# EAGLE design Servo Bonnet rev B (EAGLE 6.4)

## Sheet 1 of 2
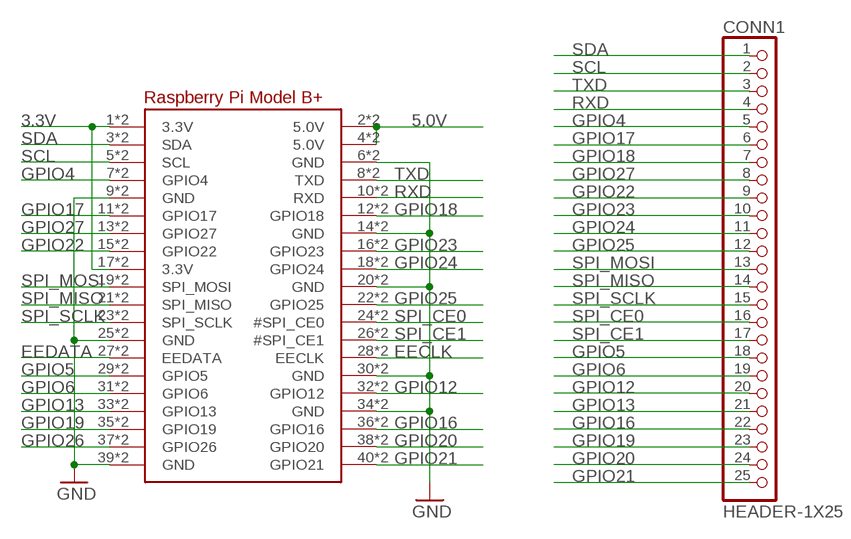
[diagram p0: schematic, sheet 1]

### Parts
CONN1  HEADER-1X25  [1X25_ROUND_70MIL]
RPI1  RASPBERRYPI_BPLUS_BONNET_THMSMT  [PI_BONNET_THMSMT]

### Nets
3.3V: RPI1.1(3.3V) RPI1.17(3.3V) RPI1.S1(3.3V) RPI1.S17(3.3V) ; also sheet 2
5.0V: RPI1.2(5.0V) RPI1.4(5.0V) RPI1.S2(5.0V) RPI1.S4(5.0V) ; also sheet 2
EECLK: RPI1.28(EECLK) RPI1.S28(EECLK)
EEDATA: RPI1.27(EEDATA) RPI1.S27(EEDATA)
GND: RPI1.6(GND) RPI1.9(GND) RPI1.14(GND) RPI1.20(GND) RPI1.25(GND) RPI1.30(GND) RPI1.34(GND) RPI1.39(GND) RPI1.S6(GND) RPI1.S9(GND) RPI1.S14(GND) RPI1.S20(GND) RPI1.S25(GND) RPI1.S30(GND) RPI1.S34(GND) RPI1.S39(GND) ; also sheet 2
GPIO4: CONN1.5 RPI1.7(GPIO4) RPI1.S7(GPIO4)
GPIO5: CONN1.18 RPI1.29(GPIO5) RPI1.S29(GPIO5)
GPIO6: CONN1.19 RPI1.31(GPIO6) RPI1.S31(GPIO6)
GPIO12: CONN1.20 RPI1.32(GPIO12) RPI1.S32(GPIO12)
GPIO13: CONN1.21 RPI1.33(GPIO13) RPI1.S33(GPIO13)
GPIO16: CONN1.22 RPI1.36(GPIO16) RPI1.S36(GPIO16)
GPIO17: CONN1.6 RPI1.11(GPIO17) RPI1.S11(GPIO17)
GPIO18: CONN1.7 RPI1.12(GPIO18) RPI1.S12(GPIO18)
GPIO19: CONN1.23 RPI1.35(GPIO19) RPI1.S35(GPIO19)
GPIO20: CONN1.24 RPI1.38(GPIO20) RPI1.S38(GPIO20)
GPIO21: CONN1.25 RPI1.40(GPIO21) RPI1.S40(GPIO21)
GPIO22: CONN1.9 RPI1.15(GPIO22) RPI1.S15(GPIO22)
GPIO23: CONN1.10 RPI1.16(GPIO23) RPI1.S16(GPIO23)
GPIO24: CONN1.11 RPI1.18(GPIO24) RPI1.S18(GPIO24)
GPIO25: CONN1.12 RPI1.22(GPIO25) RPI1.S22(GPIO25)
GPIO26: RPI1.37(GPIO26) RPI1.S37(GPIO26)
GPIO27: CONN1.8 RPI1.13(GPIO27) RPI1.S13(GPIO27)
RXD: CONN1.4 RPI1.10(RXD) RPI1.S10(RXD)
SCL: CONN1.2 RPI1.5(SCL) RPI1.S5(SCL) ; also sheet 2
SDA: CONN1.1 RPI1.3(SDA) RPI1.S3(SDA) ; also sheet 2
SPI_CE0: CONN1.16 RPI1.24(#SPI_CE0) RPI1.S24(#SPI_CE0)
SPI_CE1: CONN1.17 RPI1.26(#SPI_CE1) RPI1.S26(#SPI_CE1)
SPI_MISO: CONN1.14 RPI1.21(SPI_MISO) RPI1.S21(SPI_MISO)
SPI_MOSI: CONN1.13 RPI1.19(SPI_MOSI) RPI1.S19(SPI_MOSI)
SPI_SCLK: CONN1.15 RPI1.23(SPI_SCLK) RPI1.S23(SPI_SCLK)
TXD: CONN1.3 RPI1.8(TXD) RPI1.S8(TXD)

## Sheet 2 of 2
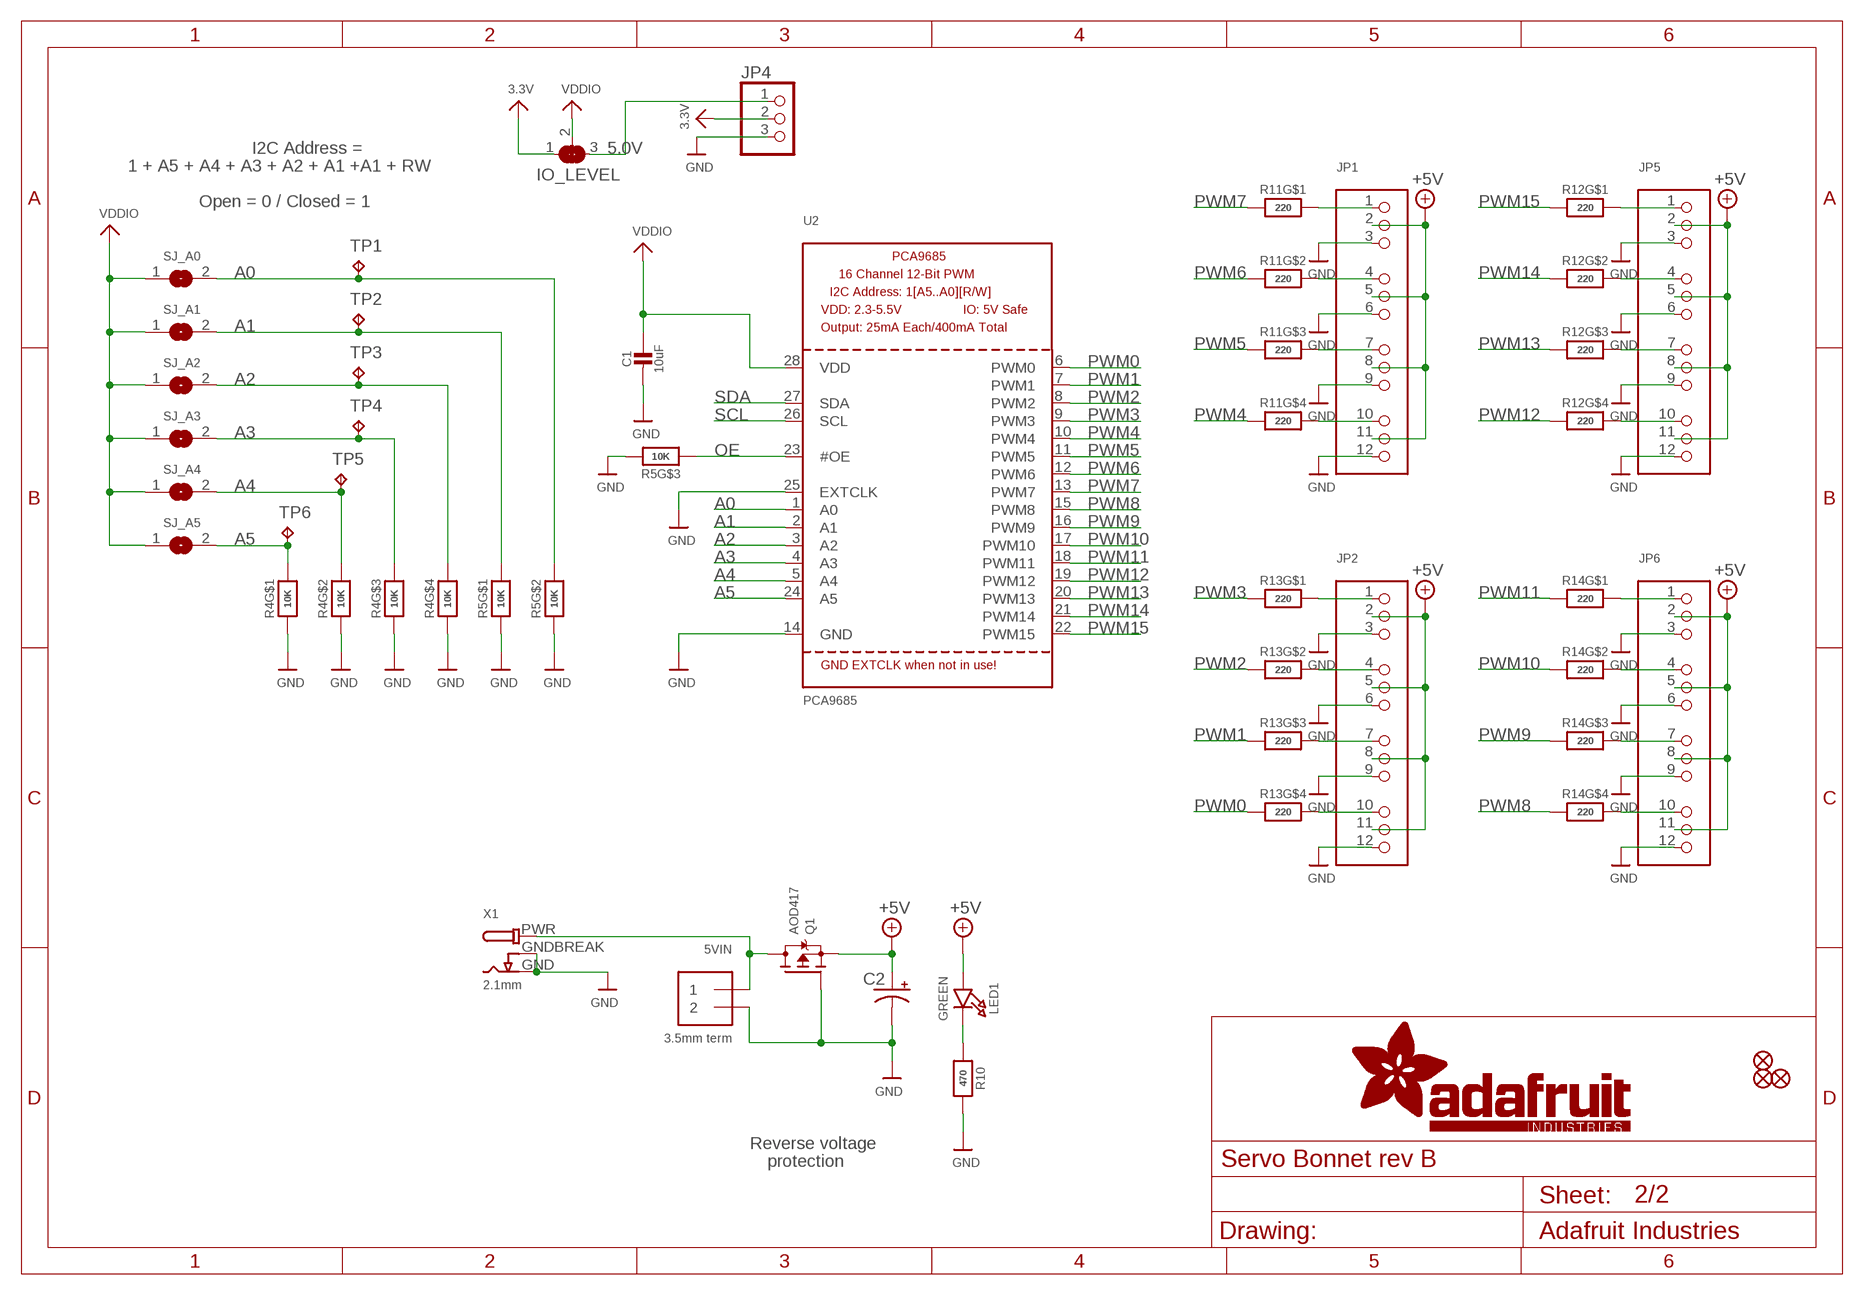
[diagram p1: schematic, sheet 2]

### Parts
5VIN  3.5mm term  TERMBLOCK_1X2  [TERMBLOCK_1X2-3.5MM]
C1  10uF  CAP_CERAMIC0805-NOOUTLINE  [0805-NO]
C2  CPOL-USE3.5-8  [E3,5-8]
FID1  FIDUCIAL_1MM  [FIDUCIAL_1MM]
FID2  FIDUCIAL_1MM  [FIDUCIAL_1MM]
FID3  FIDUCIAL_1MM  [FIDUCIAL_1MM]
IO_LEVEL  SOLDERJUMPER_2WAY  [SOLDERJUMPER_2WAY_OPEN_NOPASTE]
JP1  HEADER-3X04  [3X04]
JP2  HEADER-3X04  [3X04]
JP4  HEADER-1X3ROUND  [1X03_ROUND]
JP5  HEADER-3X04  [3X04]
JP6  HEADER-3X04  [3X04]
LED1  GREEN  LED0805_NOOUTLINE  [CHIPLED_0805_NOOUTLINE]
Q1  AOD417  MOSFET-PTO252  [TO252]
R4  10K  RESISTOR_4PACK  [RESPACK_4X0603]
R5  10K  RESISTOR_4PACK  [RESPACK_4X0603]
R10  470  RESISTOR_0603_NOOUT  [0603-NO]
R11  220  RESISTOR_4PACK  [RESPACK_4X0603]
R12  220  RESISTOR_4PACK  [RESPACK_4X0603]
R13  220  RESISTOR_4PACK  [RESPACK_4X0603]
R14  220  RESISTOR_4PACK  [RESPACK_4X0603]
SJ_A0  SOLDERJUMPERREFLOW_NOPASTE  [SOLDERJUMPER_REFLOW_NOPASTE]
SJ_A1  SOLDERJUMPERREFLOW_NOPASTE  [SOLDERJUMPER_REFLOW_NOPASTE]
SJ_A2  SOLDERJUMPERREFLOW_NOPASTE  [SOLDERJUMPER_REFLOW_NOPASTE]
SJ_A3  SOLDERJUMPERREFLOW_NOPASTE  [SOLDERJUMPER_REFLOW_NOPASTE]
SJ_A4  SOLDERJUMPERREFLOW_NOPASTE  [SOLDERJUMPER_REFLOW_NOPASTE]
SJ_A5  SOLDERJUMPERREFLOW_NOPASTE  [SOLDERJUMPER_REFLOW_NOPASTE]
TP1  TPB1,27  [B1,27]
TP2  TPB1,27  [B1,27]
TP3  TPB1,27  [B1,27]
TP4  TPB1,27  [B1,27]
TP5  TPB1,27  [B1,27]
TP6  TPB1,27  [B1,27]
U2  PCA9685  [TSSOP28]
X1  2.1mm  DCBARRELPTH  [DCJACK_2MM_PTH]

### Nets
3.3V: IO_LEVEL.1 JP4.2 ; also sheet 1
5.0V: IO_LEVEL.3 JP4.1 ; also sheet 1
+5V: C2.+ JP1.2 JP1.5 JP1.8 JP1.11 JP2.2 JP2.5 JP2.8 JP2.11 JP5.2 JP5.5 JP5.8 JP5.11 JP6.2 JP6.5 JP6.8 JP6.11 LED1.A Q1.2(S)
A0: R5.7 SJ_A0.2 TP1.TP U2.1(A0)
A1: R5.8 SJ_A1.2 TP2.TP U2.2(A1)
A2: R4.5 SJ_A2.2 TP3.TP U2.3(A2)
A3: R4.6 SJ_A3.2 TP4.TP U2.4(A3)
A4: R4.7 SJ_A4.2 TP5.TP U2.5(A4)
A5: R4.8 SJ_A5.2 TP6.TP U2.24(A5)
GND: 5VIN.2 C1.2 C2.- JP1.3 JP1.6 JP1.9 JP1.12 JP2.3 JP2.6 JP2.9 JP2.12 JP4.3 JP5.3 JP5.6 JP5.9 JP5.12 JP6.3 JP6.6 JP6.9 JP6.12 Q1.1(G) R4.1 R4.2 R4.3 R4.4 R5.1 R5.2 R5.6 R10.2 U2.14(GND) U2.25(EXTCLK) X1.GND X1.GNDBREAK ; also sheet 1
N$24: LED1.C R10.1
N$25: JP1.4 R11.7
N$26: JP1.1 R11.8
N$27: JP1.7 R11.6
N$28: JP1.10 R11.5
N$29: JP2.1 R13.8
N$30: JP2.4 R13.7
N$31: JP2.7 R13.6
N$32: JP2.10 R13.5
N$33: JP6.10 R14.5
N$34: JP6.7 R14.6
N$35: JP6.4 R14.7
N$36: JP6.1 R14.8
N$37: JP5.10 R12.5
N$38: JP5.7 R12.6
N$40: JP5.4 R12.7
N$63: JP5.1 R12.8
OE: R5.3 U2.23(#OE)
PWM0: R13.4 U2.6(PWM0)
PWM1: R13.3 U2.7(PWM1)
PWM2: R13.2 U2.8(PWM2)
PWM3: R13.1 U2.9(PWM3)
PWM4: R11.4 U2.10(PWM4)
PWM5: R11.3 U2.11(PWM5)
PWM6: R11.2 U2.12(PWM6)
PWM7: R11.1 U2.13(PWM7)
PWM8: R14.4 U2.15(PWM8)
PWM9: R14.3 U2.16(PWM9)
PWM10: R14.2 U2.17(PWM10)
PWM11: R14.1 U2.18(PWM11)
PWM12: R12.4 U2.19(PWM12)
PWM13: R12.3 U2.20(PWM13)
PWM14: R12.2 U2.21(PWM14)
PWM15: R12.1 U2.22(PWM15)
PWR: 5VIN.1 Q1.3(D) X1.PWR
SCL: U2.26(SCL) ; also sheet 1
SDA: U2.27(SDA) ; also sheet 1
VDDIO: C1.1 IO_LEVEL.2 SJ_A0.1 SJ_A1.1 SJ_A2.1 SJ_A3.1 SJ_A4.1 SJ_A5.1 U2.28(VDD)
Unconnected: R5.4 R5.5

### Notes on the sheet
- I2C Address =
- 1 + A5 + A4 + A3 + A2 + A1 +A1 + RW
- Open = 0 / Closed = 1
- Reverse voltage
- protection

## Library data of the parts
5VIN = microbuilder:TERMBLOCK_1X2: 3.5mm Terminal block http://www.ladyada.net/library/pcb/eaglelibrary.html
C1 = microbuilder:CAP_CERAMIC: Ceramic Capacitors For new designs, use the packages preceded by an '_' character since they are more reliable: The following footprints should be used on most boards: _0402 - Standard footprint for regular board layouts _0603 - Standard footprint for regular board layouts _0805 - Standard footprint for regular board layouts _1206 - Standard footprint for regular board layouts For extremely tight-pitch boards where space is at a premium, the following 'micro-pitch' footprints can be used (smaller pads, no silkscreen outline, etc.): _0402MP - Micro-pitch footprint for very dense/compact boards _0603MP - Micro-pitch footprint for very dense/compact boards _0805MP - Micro-pitch footprint for very dense/compact boards _1206MP - Micro-pitch footprint for very dense/compact boards
C2 = adafruit:CPOL-US: POLARIZED CAPACITOR, American symbol
CONN1 = microbuilder:HEADER-1X25
FID1-FID3 = microbuilder:FIDUCIAL: Fiducial Alignment Points Various fiducial points for machine vision alignment.; BOM: EXCLUDE
IO_LEVEL = microbuilder:SOLDERJUMPER_2WAY: 2-Way Solder Jumper
JP1 JP2 JP5 JP6 = microbuilder:HEADER-3X04
JP4 = microbuilder:HEADER-1X3: PIN HEADER
LED1 = microbuilder:LED: LED 0603 - 0603 Surface Mount Package 2mA: Green LED - Low Power (3.9mcd, 2ma, 1.7Vf) - Digikey: 475-2709-2-ND Orange LED - Low Power (9.8mcd, 2ma, 1.8Vf) - Digikey: 475-1194-2-ND Red LED - Low Power (5mcd, 2ma, 1.8Vf) - Digikey: 475-1195-2-ND Yellow LED - Low Power (7mcd, 2ma, 1.8Vf) - Digikey: 475-1196-2-ND 5mA: Blue LED - Low Power (17mcd, 5ma, 2.9Vf) - Digikey: LNJ937W8CRACT-ND 0805 - 0805 Surface Mount Package 2mA: Red LED (8.8mcd, 2mA, 1.8Vf, Clear) - Low Power [Digikey: 475-2510-1-ND] Green LED (5mcd, 2mA, 1.8Vf, Clear) - Low Power [Digikey: 475-2730-1-ND] Yellow LED (11.3mcd, 2mA, 1.8Vf, Clear) - Low Power [Digikey: 475-2555-1-ND] 20mA: Red LED (104mcd, 20mA, Diffused) - LS R976 [Digikey: 475-1278-6-ND] Red LED (12mcd, 20mA, 2.0Vf, Clear) - APT2012EC [Digikey: 754-1128-1-ND] Green LED (15mcd, 20mA, 2.2Vf, Clear) - APT2012GC [Digikey: 754-1131-1-ND] Orange LED (160mcd, 20mA, 2.1Vf, Clear) - APT2012SECK [Digikey: 754-1130-1-ND] 1206 - 1206 Surface Mount Package Green LED (26mcd, 20mA, Diffused) - LG N971 [Digikey: 475-1407-6-ND] Red LED (15mcd, 20mA, Diffused) - LH N974 [Digikey: 475-1416-6-ND] Cree - Cree High-Power Surface Mount LEDs XPEBWT-L1-0000-00D50 - White 111lm 350mA 2.9Vf 6200K 110° XTEAWT-00-0000-00000LEE3 - White 114lm 350mA 2.85Vf 5000K 115° Everlight - Everlight 45-21 Series Surface Mount LEDs 45-21/QK2C-B2832AC2CB2/2T - Warm White 2000mcd 20mA 3.25Vf 3050K 120° 45-21/LK2C-B38452C4CB2/2T - Nuetral White 2000mcd 20mA 3.25Vf 4150K 120° 45-21/LK2C-B50634C6CB2/2T - Cold White 2200mcd 20mA 3.25Vf 5650K 120° PLCC2 Reverse Mount LS T77K-J1L2-1-0-2-R18-Z - Red 11.25mcd 2mA 1.8Vf 630nm 120° LO T77K-L1M2-24-Z - Orange 19.6mcd 2mA 1.8Vf 606nm 120° LY T77K-K2M1-26-Z - Yellow 15.7mcd 2mA 1.8Vf 587nm 120°
Q1 = microbuilder:MOSFET-P: P-Channel Mosfet LEGEND VDS: Voltage Drain-Source ID: Drain Current RDS(ON): Drain-Source On-State Resistance VGS(TH): Gate-Source Threshold Voltage CISS: Drain-Source Input Capacitance SOT-23 Name VDS ID RDS(ON) VGS(TH) CISS Order Number IRLML5103 30V 760mA 600 mOhm -- 75pF @ 25V Digikey: IRLML5103PBFCT-ND IRLML6401 12V 4.3A 50 mOhm 950mV @ 250µA 830pF @ 10V Digikey: IRLML6401PBFTR-ND NTR0202PL 20V 400mA 800 mOhm 2.3V @ 250uA 70pF @ 5V Digikey: NTR0202PLT1GOSTR-ND NTR4101PT1G 20V 1.8A 85 mOhm 1.2V @ 250uA 675pF @ 10V Digikey: NTR4101PT1GOSCT-ND DMP2004K 20V 600mA 900 mOhm 1V @ 250uA 175pF @ 16V Digikey: DMP2004KDICT-ND PMV65XP 20V 3.9A 76 mOhm 950mV @ 1mA 725pF @ 20V Digikey: 568-2358-2-ND TO-252 Name VDS ID RDS(ON) VGS(TH) CISS Order Number AOD417 30V 25A 34 mOhm 3V @ 250µA 920pF @ 15V Digikey: 785-1106-2-ND PowerPak Name VDS ID RDS(ON) VGS(TH) CISS Order Number AON7401 30V 12A 14 mOhm 3V @ 250µA 2600pF @ 15V Digikey: 785-1302-1-ND
R4 R5 R11-R14 = microbuilder:RESISTOR_4PACK: Resistor Packs (4 resistors) 4 x 0603 10K 1/16W - Digikey: YC164J-10KCT-ND
R10 = microbuilder:RESISTOR: Resistors For new designs, use the packages preceded by an '_' character since they are more reliable: The following footprints should be used on most boards: _0402 - Standard footprint for regular board layouts _0603 - Standard footprint for regular board layouts _0805 - Standard footprint for regular board layouts _1206 - Standard footprint for regular board layouts For extremely tight-pitch boards where space is at a premium, the following 'micro-pitch' footprints can be used (smaller pads, no silkscreen outline, etc.): _0402MP - Micro-pitch footprint for very dense/compact boards _0603MP - Micro-pitch footprint for very dense/compact boards _0805MP - Micro-pitch footprint for very dense/compact boards _1206MP - Micro-pitch footprint for very dense/compact boards
RPI1 = microbuilder:RASPBERRYPI_BPLUS
SJ_A0 SJ_A1-SJ_A5 = microbuilder:SOLDERJUMPER: SMD Solder JUMPER Solder the two pads together to create a connection, or remove the solder to break it. REFLOW - Use this footprint for solder paste and reflow ovens. WAVE - Use this footprint for hand-soldering (larger pads). CLOSED - Has a trace between the two pads to ensure it is closed by default. The trace needs to be cut to disable the jumper, and can be closed again by creating a solder bridge between the two pads.
TP1-TP6 = testpad:TP: Test pad
U2 = microbuilder:PCA9685: PCA9685 - 16 Channel 12-Bit I2C PWM Controller 5.0V tolerant 16 channel, 12-bit I2C PWM controller with 25mA per output (max. 400mA total) Digikey: 568-5931-1-ND
X1 = microbuilder:DCBARREL: DC Barrel Jack DCJACK_1.3MM_PTH - Through Hole 1.3mm Jack (4UConnector: 05536) DCJACK_2MM_PTH - Through Hole 2.0/2.1 Jack (4UConnector: 05537) DCJACK_2MM_SMT - SMT 2.0/2.1mm Jack(4UConnector: 03267)

## Board
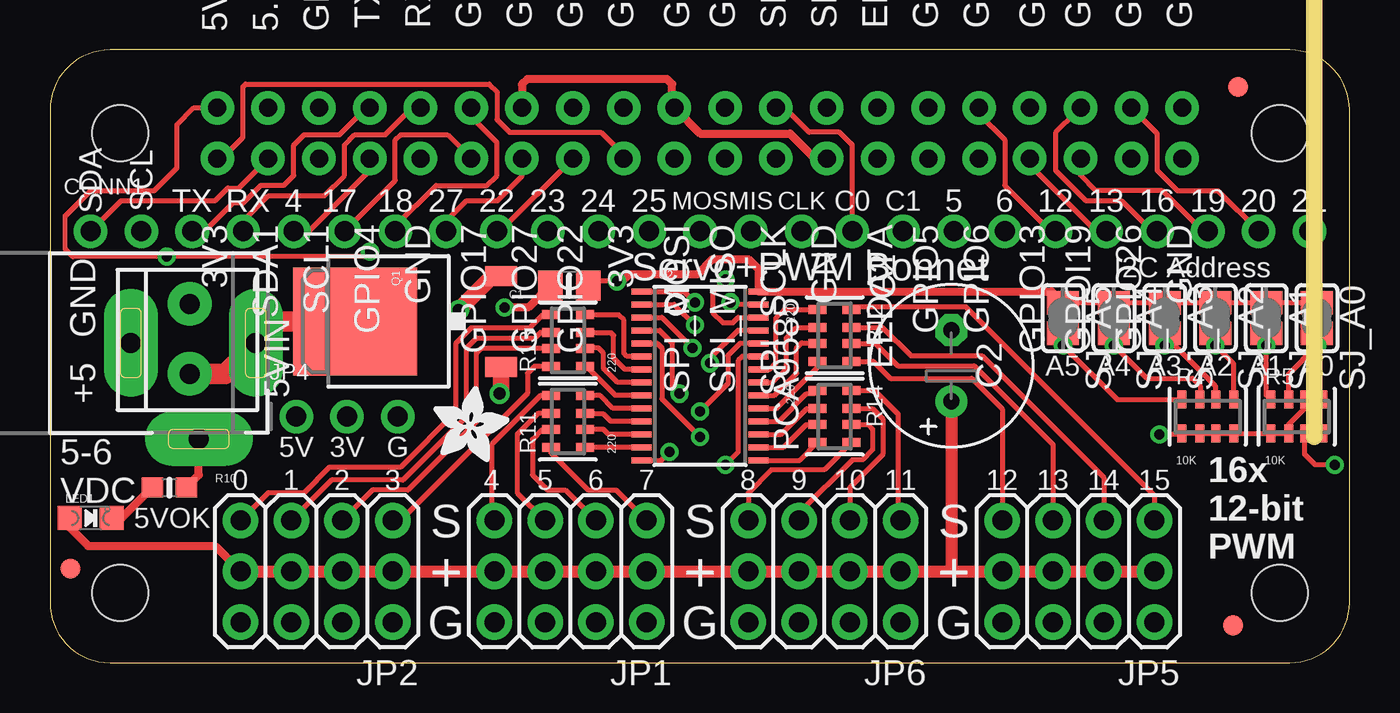
[diagram p2: board, top side]
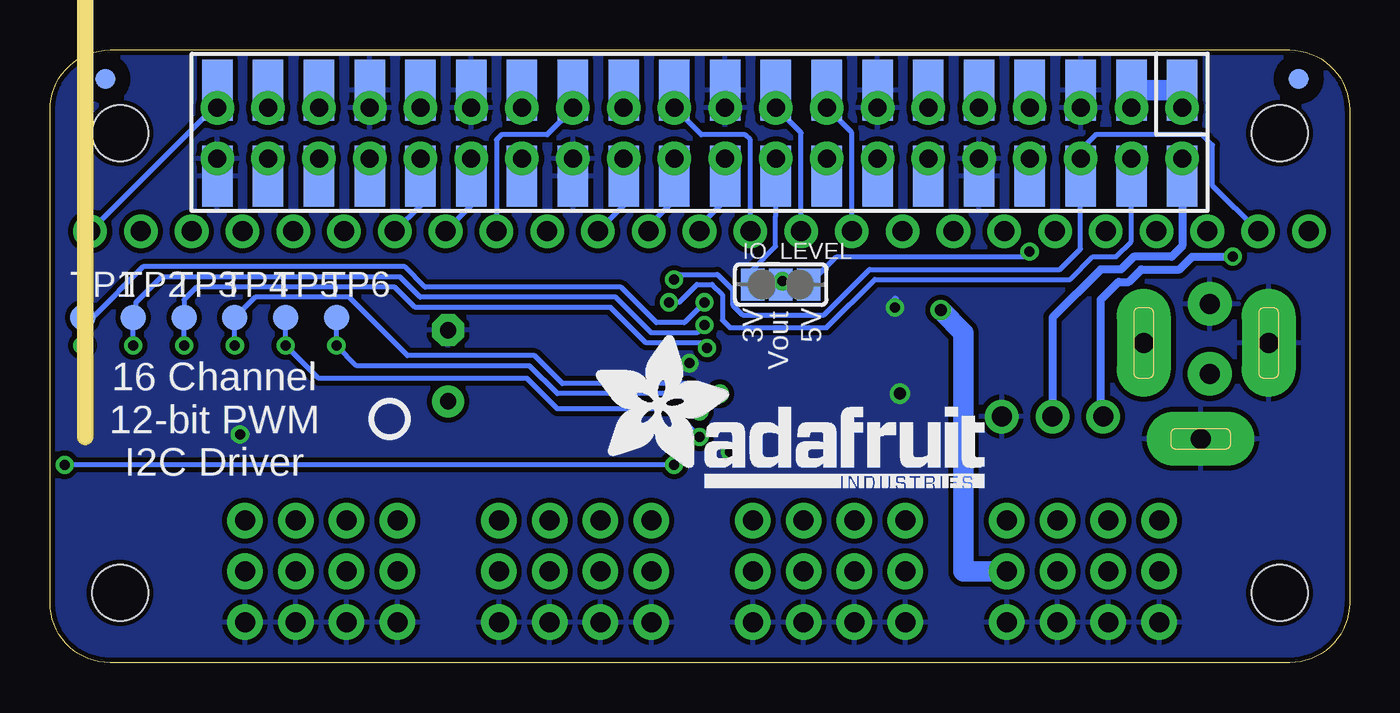
[diagram p3: board, bottom side, seen from below]

Size 65 x 30.66 mm. Coordinates in mm from the lower left corner, seen from the top.
Copper layers (1*16): Top 0.035mm / dielectric 1.5mm / Bottom 0.035mm
Design rules "adafruit *": minimum track width 8mil, minimum drill 15.5mil, track to track 8mil, track to pad 8mil, pad to pad 8mil, via to via 8mil, smd to smd 8mil, copper to edge 10mil, drill to drill 8mil, minimum pad ring 10mil, minimum via ring 8mil, stop-mask expansion 2mil, vias tented up to drill 20mil, thermal gap 10mil
Milling: 1 lines

### Footprints (pad centres in the part's own frame; a part is rotated, then mirrored left to right if it is on the bottom)
TERMBLOCK_1X2-3.5MM = drill 1 pad 2.184: 1 1.8,0; 2 -1.7,0
0805-NO = smd 1.24 x 1.5: 1 -0.95,0; 2 0.95,0
E3,5-8 = drill 0.813 pad 1.6: + -1.778,0 | drill 0.813 pad 1.6 octagon: - 1.778,0
1X25_ROUND_70MIL = drill 1 pad 1.676: 1 -30.48,0; 2 -27.94,0; 3 -25.4,0; 4 -22.86,0; 5 -20.32,0; 6 -17.78,0; 7 -15.24,0; 8 -12.7,0; 9 -10.16,0; 10 -7.62,0; 11 -5.08,0; 12 -2.54,0; 13 0,0; 14 2.54,0; 15 5.08,0; 16 7.62,0; 17 10.16,0; 18 12.7,0; 19 15.24,0; 20 17.78,0; 21 20.32,0; 22 22.86,0; 23 25.4,0; 24 27.94,0; 25 30.48,0
FIDUCIAL_1MM = smd 1 x 1: 1 0,0
SOLDERJUMPER_2WAY_OPEN_NOPASTE = smd 1.168 x 1.6: 1 -1.397,0; 2 0,0; 3 1.397,0
3X04 = drill 1 pad 1.778: 1 -3.81,-2.54; 2 -3.81,0; 3 -3.81,2.54; 4 -1.27,-2.54; 5 -1.27,0; 6 -1.27,2.54; 7 1.27,-2.54; 8 1.27,0; 9 1.27,2.54; 10 3.81,-2.54; 11 3.81,0; 12 3.81,2.54
1X03_ROUND = drill 1 pad 1.676: 1 -2.54,0; 2 0,0; 3 2.54,0
CHIPLED_0805_NOOUTLINE = smd 1.2 x 1.2: A 0,-1.05; C 0,1.05
TO252 = smd 1 x 1.6: 1 -2.28,-4.8; 2 2.28,-4.8 | smd 5.4 x 6.2: 3 0,2.5
RESPACK_4X0603 = smd 0.45 x 0.9: 1 -1.3,-0.85; 2 -0.4,-0.85; 3 0.4,-0.85; 4 1.3,-0.85; 5 1.3,0.85; 6 0.4,0.85; 7 -0.4,0.85; 8 -1.3,0.85
0603-NO = smd 1.075 x 1: 1 -0.85,0; 2 0.85,0
PI_BONNET_THMSMT = drill 0.9 pad 1.676: 1 8.37,25.23; 2 8.37,27.77; 3 10.91,25.23; 4 10.91,27.77; 5 13.45,25.23; 6 13.45,27.77; 7 15.99,25.23; 8 15.99,27.77; 9 18.53,25.23; 10 18.53,27.77; 11 21.07,25.23; 12 21.07,27.77; 13 23.61,25.23; 14 23.61,27.77; 15 26.15,25.23; 16 26.15,27.77; 17 28.69,25.23; 18 28.69,27.77; 19 31.23,25.23; 20 31.23,27.77; 21 33.77,25.23; 22 33.77,27.77; 23 36.31,25.23; 24 36.31,27.77; 25 38.85,25.23; 26 38.85,27.77; 27 41.39,25.23; 28 41.39,27.77; 29 43.93,25.23; 30 43.93,27.77; 31 46.47,25.23; 32 46.47,27.77; 33 49.01,25.23; 34 49.01,27.77; 35 51.55,25.23; 36 51.55,27.77; 37 54.09,25.23; 38 54.09,27.77; 39 56.63,25.23; 40 56.63,27.77 | smd 1 x 1 bottom: 41 2.54,29.21; 42 62.23,29.21 | smd 1.524 x 3.048 bottom: S1 8.37,24.339; S2 8.37,28.657; S3 10.91,24.339; S4 10.91,28.657; S5 13.45,24.339; S6 13.45,28.657; S7 15.99,24.339; S8 15.99,28.657; S9 18.53,24.339; S10 18.53,28.657; S11 21.07,24.339; S12 21.07,28.657; S13 23.61,24.339; S14 23.61,28.657; S15 26.15,24.339; S16 26.15,28.657; S17 28.69,24.339; S18 28.69,28.657; S19 31.23,24.339; S20 31.23,28.657; S21 33.77,24.339; S22 33.77,28.657; S23 36.31,24.339; S24 36.31,28.657; S25 38.85,24.339; S26 38.85,28.657; S27 41.39,24.339; S28 41.39,28.657; S29 43.93,24.339; S30 43.93,28.657; S31 46.47,24.339; S32 46.47,28.657; S33 49.01,24.339; S34 49.01,28.657; S35 51.55,24.339; S36 51.55,28.657; S37 54.09,24.339; S38 54.09,28.657; S39 56.63,24.339; S40 56.63,28.657 | hole 2.8: 3.5,26.5; 61.5,26.5; 61.5,3.5; 3.5,3.5
SOLDERJUMPER_REFLOW_NOPASTE = smd 1.168 x 1.6: 1 -0.762,0; 2 0.762,0
B1,27 = smd 1.27 x 1.27: TP 0,0
TSSOP28 = smd 0.305 x 0.991: 1 -4.225,-2.918; 2 -3.575,-2.918; 3 -2.925,-2.918; 4 -2.275,-2.918; 5 -1.625,-2.918; 6 -0.975,-2.918; 7 -0.325,-2.918; 8 0.325,-2.918; 9 0.975,-2.918; 10 1.625,-2.918; 11 2.275,-2.918; 12 2.925,-2.918; 13 3.575,-2.918; 14 4.225,-2.918; 15 4.225,2.918; 16 3.575,2.918; 17 2.925,2.918; 18 2.275,2.918; 19 1.625,2.918; 20 0.975,2.918; 21 0.325,2.918; 22 -0.325,2.918; 23 -0.975,2.918; 24 -1.625,2.918; 25 -2.275,2.918; 26 -2.925,2.918; 27 -3.575,2.918; 28 -4.225,2.918
DCJACK_2MM_PTH = drill 1 pad 2.7 long: GND 7.35,0; GNDBREAK 10.75,-4.8; PWR 13.6,0

### Placement (x,y rotation side)
5VIN  6.99,16.26 270 top
C1  25.97,18.88 180 top
C2  45.09,14.86 90 top
CONN1  32.51,21.59 0 top
FID1  59.17,1.87 0 top
FID2  59.44,28.8 0 top
FID3  1.02,4.7 0 top
IO_LEVEL  28.45,18.92 0 bottom
JP1  26.04,4.57 180 top
JP2  13.34,4.57 180 top
JP4  14.86,12.32 0 top
JP5  51.44,4.57 180 top
JP6  38.73,4.57 180 top
LED1  2.03,7.24 270 top
Q1  17.77,17.08 90 top
R4  57.91,12.32 0 top
R5  62.36,12.32 0 top
R10  5.97,8.76 0 top
R11  25.91,12.06 90 top
R12  39.24,16.38 270 top
R13  25.91,16.13 90 top
R14  39.24,12.32 270 top
RPI1  0,0 0 top
SJ_A0  63.37,17.24 270 top
SJ_A1  60.83,17.24 270 top
SJ_A2  58.29,17.24 270 top
SJ_A3  55.75,17.24 270 top
SJ_A4  53.21,17.24 270 top
SJ_A5  50.67,17.24 270 top
TP1  63.37,17.27 0 bottom
TP2  60.83,17.27 0 bottom
TP3  58.29,17.27 0 bottom
TP4  55.75,17.27 0 bottom
TP5  53.21,17.27 0 bottom
TP6  50.67,17.27 0 bottom
U2  32.51,14.35 270 top
U$6  [ADAFRUIT_TEXT_20MM]  37.85,8.76 0 bottom
U$8  [ADAFRUIT_3.5MM]  19.18,10.03 0 top
U$11  [PCBFEAT-REV-040]  48.01,12.19 0 bottom
X1  -3.3,16 0 top

### Tracks (layer width: path | path; a pad name or v marks a point on that pad's centre or on a via)
3.3V
  Top 0.254: RPI1.1 8.59,25.23 9.65,26.29 9.65,28.83 9.78,28.96 21.97,28.96 22.35,28.57 22.35,27.18 22.99,26.54 27.56,26.54 28.69,25.41 RPI1.17
  Bottom 0.254: RPI1.17 RPI1.S17 28.69,22.36 28.7,22.35 28.7,20.83 29.84,19.68 IO_LEVEL.1 | RPI1.17 | RPI1.S1 RPI1.1 | RPI1.1
  Bottom 0.406: RPI1.S1 8.37,20.84 8.89,20.32 10.79,20.32 11.43,19.68 12.45,19.68 14.86,17.27 JP4.2
5.0V  (via drill 0.5)
  Top 0.254: v16,20.57 15.75,20.32 v5.84,20.32 | 5.59,20.32 1.14,20.32 0.76,20.7 0.76,22.35 2.03,23.62 5.21,23.62 6.35,24.77 6.35,26.92 7.2,27.77 RPI1.2
  Top 0.406: v5.84,20.32 5.59,20.32
  Bottom 0.254: RPI1.S2 RPI1.2 | RPI1.2 | RPI1.S4 RPI1.4 | RPI1.4 | IO_LEVEL.3 25.65,20.32 16.26,20.32 v16,20.57
  Bottom 0.406: JP4.1 12.45,12.19 12.45,18.16 11.56,19.05 11.05,19.05 10.41,19.68 8.51,19.68 7.87,20.32 v5.84,20.32
  Bottom 1.016: RPI1.S2 RPI1.S4
+5V  (via drill 0.6)
  Top 0.254: Q1.2 22.54,19.36 22.48,19.3
  Top 0.406: LED1.A 0.98,6.76 1.91,5.84 8.26,5.84 JP2.11
  Top 0.61: JP2.11 JP2.8 JP2.5 JP2.2 JP1.11 JP1.8 JP1.5 JP1.2 JP6.11 JP6.8 JP6.5 JP6.2 45.09,4.57 | 45.09,4.57 JP5.11 JP5.8 JP5.5 JP5.2 | C2.+ 45.09,4.57
  Top 0.813: 22.51,19.3 22.48,19.3 22.1,19.3 v20.45,17.65
  Bottom 1.016: v20.45,17.65 19.3,16.51 19.3,4.57 JP2.2
A0  (via drill 0.5)
  Top 0.254: U2.1 31.72,18.58 v32.26,18.03 | SJ_A0.2 v63.37,15.88 61.96,14.46 R5.7
  Bottom 0.254: v32.26,18.03 33.27,17.02 34.67,17.02 36.45,18.8 46.23,18.8 47.24,19.81 60.33,19.81 62.87,17.27 TP1.TP v63.37,15.88
A1  (via drill 0.5)
  Top 0.254: U2.2 31.22,17.93 v32.26,16.89 | 61.06,16.25 SJ_A1.2 v60.83,15.88 60.83,13.39 R5.8
  Bottom 0.254: v32.26,16.89 32.64,16.51 34.92,16.51 36.7,18.29 46.48,18.29 47.5,19.3 59.44,19.3 60.71,18.03 60.71,17.4 TP2.TP v60.83,15.88
A2  (via drill 0.5)
  Top 0.254: U2.3 30.6,17.28 v32.13,15.75 | R4.5 59.18,13.2 59.18,14.99 v58.29,15.88 SJ_A2.2
  Bottom 0.254: v32.13,15.75 32.38,16 35.18,16 36.96,17.78 46.74,17.78 47.75,18.8 57.66,18.8 58.29,18.16 TP3.TP v58.29,15.88
A3  (via drill 0.5)
  Top 0.254: U2.4 30.49,16.63 31.11,16 31.11,13.84 v31.5,13.46 | SJ_A3.2 55.78,16.48 55.78,15.91 v55.75,15.88 56.26,15.88 58.29,13.84 58.29,13.19 R4.6
  Bottom 0.254: v31.5,13.46 32.51,13.46 33.02,13.97 39.37,13.97 40.77,15.37 47.12,15.37 50.04,18.29 54.74,18.29 TP4.TP v55.75,15.88
A4  (via drill 0.5)
  Top 0.254: U2.5 30.38,15.98 30.61,15.75 30.61,13.21 v32.51,11.3 | R4.7 57.53,13.19 57.53,13.84 57.15,14.22 54.86,14.22 v53.21,15.88 SJ_A4.2
  Bottom 0.254: v32.51,11.3 33.91,12.7 39.62,12.7 41.15,14.22 51.56,14.22 v53.21,15.88 TP5.TP
A5  (via drill 0.5)
  Top 0.254: U2.24 34.52,15.98 33.91,15.37 33.91,13.97 v32.51,12.57 | R4.8 53.38,13.17 v50.67,15.88 SJ_A5.2
  Bottom 0.254: v32.51,12.57 33.4,13.46 39.62,13.46 41.02,14.86 49.66,14.86 v50.67,15.88 TP6.TP
EECLK
  Bottom 0.254: RPI1.S28 RPI1.28 | RPI1.28
EEDATA
  Bottom 0.254: RPI1.27 RPI1.S27
GND  (via drill 0.5, 0.6)
  Top 0.254: U2.25 34.41,16.63 | 34.41,16.63 34.42,16.64 | 34.41,16.63 33.02,15.24 v33.02,14.99 | R5.6 62.76,12.72 61.96,11.92 R5.2 R5.1 R4.4 R4.3 R4.2 R4.1 56.57,11.43 v55.5,11.43 | U2.14 30.57,10.13 v30.99,10.54
  Top 0.406: C1.2 23.93,17.78 v22.73,17.78 | RPI1.25 38.27,25.23 37.02,26.48 32.52,26.48 RPI1.20 31.11,27.89 31.11,28.96 30.86,29.21 23.88,29.21 23.61,28.94 RPI1.14 | R10.2 7.45,9.39 X1.GNDBREAK
  Top 0.813: Q1.1 22.57,13.55 v22.48,13.46
  Bottom 0.254: v33.02,14.99 33.15,14.99 | v55.5,11.43 55.12,11.43
  Bottom 0.406: v22.73,17.78 22.73,18.16
  pour Bottom (isolate 0.254): -0.25,0.13 -0.25,30.89 65.06,30.89 65.06,0.13
GPIO4
  Top 0.254: CONN1.5 12.95,21.59 15.99,24.63 RPI1.7
  Bottom 0.254: RPI1.S7 RPI1.7 | RPI1.7
GPIO5
  Bottom 0.254: RPI1.29 RPI1.S29 | RPI1.S29 | RPI1.S29 43.93,22.87 CONN1.18
GPIO6
  Bottom 0.254: RPI1.31 RPI1.S31 | RPI1.S31 | RPI1.S31 46.47,22.87 CONN1.19
GPIO12
  Top 0.254: 46.47,27.44 RPI1.32 46.47,27.45 46.47,27.44 | 46.47,27.44 47.75,26.16 47.75,23.88 49.78,21.84 50.04,21.84 CONN1.20
  Bottom 0.254: RPI1.S32 RPI1.32 | RPI1.32
GPIO13
  Top 0.254: CONN1.21 52.32,21.59 49.01,24.9 RPI1.33
  Bottom 0.254: RPI1.33 49.01,25.16 49.02,25.15 49.02,24.35 RPI1.S33
GPIO16
  Top 0.254: 51.33,27.55 RPI1.36 51.33,27.55 | 51.33,27.55 50.29,26.51 50.29,24.64 51.82,23.11 53.59,23.11 55.12,21.59 CONN1.22
  Bottom 0.254: RPI1.S36 RPI1.36 | RPI1.36
GPIO17
  Top 0.254: CONN1.6 17.27,24.13 17.27,26.16 17.53,26.42 19.88,26.42 RPI1.11
  Bottom 0.254: RPI1.S11 RPI1.11 | RPI1.11
GPIO18
  Top 0.254: CONN1.7 17.27,21.84 19.3,23.88 21.84,23.88 22.35,24.38 22.35,26.04 21.07,27.32 RPI1.12
  Bottom 0.254: RPI1.S12 RPI1.12 | RPI1.12
GPIO19
  Top 0.254: CONN1.23 57.66,21.59 55.63,23.62 52.32,23.62 51.55,24.4 RPI1.35
  Bottom 0.254: RPI1.S35 RPI1.35 | RPI1.35
GPIO20
  Top 0.254: RPI1.38 | RPI1.38 55.37,26.49 55.37,24.64 56.39,23.62 58.42,23.62 CONN1.24
  Bottom 0.254: RPI1.S38 RPI1.38 | RPI1.38
GPIO21
  Bottom 0.254: RPI1.S40 RPI1.40 | RPI1.40 | RPI1.40 56.81,27.77 CONN1.25
GPIO22
  Top 0.254: CONN1.9 22.51,21.59 RPI1.15
  Bottom 0.254: RPI1.15 25.99,25.23 25.91,25.15 25.91,24.58 RPI1.S15
GPIO23
  Bottom 0.254: RPI1.S16 RPI1.16 | RPI1.16 | CONN1.10 24.89,26.51 RPI1.16
GPIO24
  Bottom 0.254: RPI1.S18 RPI1.18 | RPI1.18 | CONN1.11 27.43,26.51 RPI1.18
GPIO25
  Bottom 0.254: RPI1.S22 RPI1.22 | RPI1.22 | CONN1.12 29.97,26.16 30.23,26.42 32.42,26.42 RPI1.22
GPIO26
  Bottom 0.254: RPI1.S37 RPI1.37 | RPI1.37
GPIO27
  Top 0.254: CONN1.8 19.81,22.1 20.83,23.11 22.38,23.11 RPI1.S13 RPI1.13 | RPI1.13
  Bottom 0.254: RPI1.S13 RPI1.13 | RPI1.13
N$1
  Bottom 0.254: 29.34,18.92 28.96,18.92
N$24
  Top 0.406: LED1.C 3.6,7.24 R10.1
N$25
  Top 0.254: R11.7 24.62,11.66 24.13,11.18 24.13,9.4 24.89,8.64 25.78,8.64 JP1.4
N$26
  Top 0.254: R11.8 25.06,10.5 26.92,8.64 28.32,8.64 JP1.1
N$27
  Top 0.254: R11.6 24.4,12.46 23.37,11.43 23.37,8.51 JP1.7
N$28
  Top 0.254: R11.5 24.54,13.37 22.1,10.92 22.1,7.24 JP1.10
N$29
  Top 0.254: R13.8 24.23,14.83 23.88,14.48 23.88,13.46 17.53,7.11 JP2.1
N$30
  Top 0.254: R13.7 25.04,15.75 21.59,15.75 21.34,15.49 21.34,12.06 17.91,8.64 16.13,8.64 JP2.4
N$31
  Top 0.254: R13.6 24.53,16.53 24.26,16.26 21.34,16.26 20.83,15.75 20.83,12.32 17.65,9.14 14.1,9.14 JP2.7
N$32
  Top 0.254: R13.5 24.67,17.43 24,16.76 21.08,16.76 20.32,16 20.32,12.57 17.53,9.78 13.97,9.78 12.7,8.51 10.92,8.51 JP2.10
N$33
  Top 0.254: R14.5 38.73,9.65 36.07,9.65 34.92,8.51 JP6.10
N$34
  Top 0.254: R14.6 40.91,11.92 41.15,11.68 41.15,10.67 40.64,10.16 40.13,10.16 37.47,7.49 JP6.7
N$35
  Top 0.254: R14.7 41.13,12.72 41.66,12.19 41.66,10.41 40.01,8.76 JP6.4
N$36
  Top 0.254: R14.8 41.24,13.62 42.42,12.45 42.42,7.24 JP6.1
N$37
  Top 0.254: R12.5 41.18,15.08 42.04,14.22 46.1,14.22 47.62,12.7 JP5.10
N$38
  Top 0.254: R12.6 41.29,15.98 42.42,14.86 46.23,14.86 50.16,10.92 JP5.7
N$40
  Top 0.254: R12.7 41.64,16.78 43.05,15.37 46.61,15.37 52.7,9.27 JP5.4
N$63
  Top 0.254: JP5.1 55.24,8.38 45.82,17.81 40.22,17.81 R12.8
OE  (via drill 0.5)
  Top 0.254: U2.23 34.63,15.33 34.42,15.11 34.42,10.54 v33.78,9.91 | v64.26,9.91 63.28,9.91 62.76,10.43 R5.3
  Bottom 0.254: v33.78,9.91 v64.26,9.91
PWM0
  Top 0.254: U2.6 28.87,15.33 28.7,15.49 28.7,17.14 28.45,17.4 26.79,17.4 R13.4
PWM1
  Top 0.254: U2.7 28.76,14.68 28.19,15.24 28.19,16.38 28.07,16.51 26.78,16.51 R13.3
PWM2
  Top 0.254: U2.8 28.39,14.03 27.69,14.73 27.69,15.49 27.43,15.75 26.78,15.75 R13.2
PWM3
  Top 0.254: U2.9 28.28,13.38 26.83,14.83 R13.1
PWM4
  Top 0.254: U2.10 28.17,12.73 27.53,13.37 R11.4
PWM5
  Top 0.254: U2.11 28.06,12.08 27.69,12.45 26.78,12.45 R11.3
PWM6
  Top 0.254: U2.12 27.94,11.43 27.69,11.68 26.78,11.68 R11.2
PWM7
  Top 0.254: U2.13 26.77,10.78 R11.1
PWM8
  Top 0.254: U2.15 37.5,10.13 R14.4
PWM9
  Top 0.254: U2.16 36.68,10.78 37.83,11.92 R14.3
PWM10
  Top 0.254: U2.17 36.57,11.43 37.85,12.7 38.37,12.7 R14.2
PWM11
  Top 0.254: U2.18 36.46,12.08 37.85,13.46 38.24,13.46 R14.1
PWM12
  Top 0.254: U2.19 36.35,12.73 38.39,14.77 R12.4
PWM13
  Top 0.254: U2.20 36.24,13.38 37.34,14.48 37.34,15.75 37.59,16 38.37,16 R12.3
PWM14
  Top 0.254: U2.21 36.12,14.03 36.83,14.73 36.83,16.26 37.34,16.76 38.37,16.76 R12.2
PWM15
  Top 0.254: U2.22 36.01,14.68 36.32,14.99 36.32,17.27 36.73,17.68 R12.1
PWR
  Top 1.016: 5VIN.1 8.75,14.46 X1.PWR 11.38,17.08 Q1.3
RXD
  Top 0.254: CONN1.4 9.65,22.1 10.92,23.37 13.72,23.37 14.73,24.38 14.73,25.91 15.24,26.42 16.76,26.42 18.12,27.77 RPI1.10
  Bottom 0.254: RPI1.S10 RPI1.10 | RPI1.10
SCL  (via drill 0.5)
  Top 0.254: v33.78,19.18 33.15,18.54 33.15,17.53 33.66,17.02 34.16,17.02 34.42,17.28 U2.26
  Bottom 0.254: RPI1.5 RPI1.S5 13.46,24.33 13.46,20.7 14.48,19.68 24,19.68 26.29,17.4 30.35,17.4 30.86,17.91 30.86,18.67 31.62,19.43 33.53,19.43 v33.78,19.18 | RPI1.5 | CONN1.2 6.86,23.88 6.86,25.91 7.37,26.42 12.7,26.42 13.45,25.67 RPI1.5
SDA  (via drill 0.5)
  Top 0.254: CONN1.1 3.56,23.11 8.26,23.11 8.89,23.75 9.43,23.75 RPI1.3 | U2.27 34.14,17.93 v34.04,18.03
  Bottom 0.254: RPI1.3 RPI1.S3 10.92,24.33 10.92,21.08 11.68,20.32 12.83,20.32 13.97,19.18 23.75,19.18 26.16,16.76 30.99,16.76 31.37,17.14 31.37,18.41 31.88,18.92 32.64,18.92 33.53,18.03 v34.04,18.03 | RPI1.3
SPI_CE0
  Top 0.254: CONN1.16 40.13,25.91 39.5,26.54 37.97,26.54 36.75,27.77 RPI1.24
  Bottom 0.254: RPI1.S24 RPI1.24 | RPI1.24
SPI_CE1
  Bottom 0.254: RPI1.S26 RPI1.26 | RPI1.26 | RPI1.26 38.85,27.7 40.13,26.42 42.42,26.42 42.67,26.16 CONN1.17
SPI_MISO
  Bottom 0.254: RPI1.21 RPI1.S21 33.78,24.33 33.78,23.11 35.05,21.84 CONN1.14 | RPI1.21
SPI_MOSI
  Bottom 0.254: RPI1.19 RPI1.S19 31.24,24.33 31.24,23.11 32.51,21.84 CONN1.13 | RPI1.19
SPI_SCLK
  Bottom 0.254: RPI1.23 RPI1.S23 36.31,22.87 CONN1.15 | RPI1.23
TXD
  Top 0.254: RPI1.8 15.83,27.77 14.48,26.42 12.7,26.42 12.19,25.91 12.19,24.38 11.68,23.88 10.54,23.88 9.65,22.99 9.14,22.99 7.75,21.59 CONN1.3
  Bottom 0.254: RPI1.S8 RPI1.8 | RPI1.8
VDDIO  (via drill 0.5)
  Top 0.254: SJ_A0.1 SJ_A1.1 SJ_A2.1 SJ_A3.1 SJ_A4.1 SJ_A5.1 | v28.37,19.09 27.13,19.09 C1.1
  Top 0.406: SJ_A5.1 50.1,18.58 U2.28 35.43,19.69 34.92,20.19 33.15,20.19 32.38,19.43 28.96,19.43 28.61,19.09 v28.37,19.09
  Bottom 0.254: IO_LEVEL.2 28.45,19.01 v28.37,19.09

### Text on the board
tPlace: SDA | SCL | TX | RX | 4 | 17 | 18 | 27 | 22 | 23 | 24 | 25 | MOS | MIS | CLK | C0 | C1 | 5 | 6 | 12 | 13 | 16 | 19 | 20 | 21 | Servo+PWM Bonnet | I2C Address | PCA9685 | GND | C2 | A5 | A4 | A3 | A2 | A1 | A0 | +5 | 5V | 3V | G | 0 | 1 | 2 | 3 | 4 | 5 | 6 | 7 | 8 | 9 | 10 | 11 | 12 | 13 | 14 | 15 | 5-6 / VDC | 5VOK | S | S | S | + | + | + | 16x / 12-bit / PWM | G | G | G
bPlace: 5V | 3V | Vout | 16 Channel / 12-bit PWM / I2C Driver
tValues: 220 ohm | 220 ohm | 10K | 10K
tPlaceBlue: GND
tPlaceRed: +5V | +3V